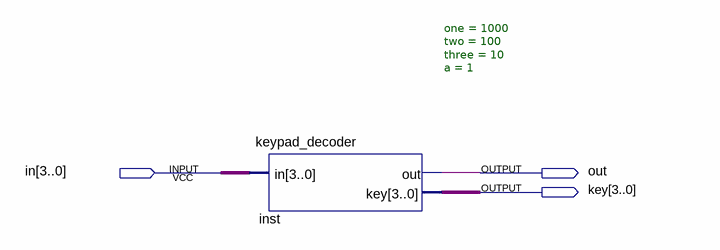
[diagram p0: schematic sheet]
// Quartus schematic keypad_decoder_nios.bdf as structural Verilog: 1 symbols, 3 pins
module keypad_decoder_nios (
  input  [3:0] in,
  output out,
  output [3:0] key
);

  keypad_decoder #(.one(1000), .two(100), .three(10), .a(1)) inst (.in(in), .out(out), .key(key));
endmodule
